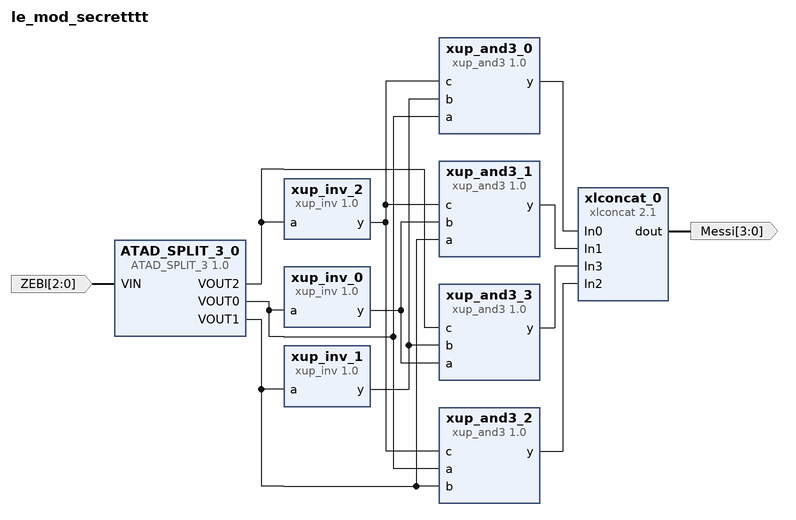
[diagram p0: block diagram of the top level]
# Vivado block design le_mod_secretttt, xc7a100tcsg324-1, Vivado 2018.3
create_bd_design le_mod_secretttt

create_bd_port -dir I -from 2 -to 0 ZEBI
create_bd_port -dir O -from 3 -to 0 Messi

create_bd_cell -type ip -vlnv xilinx.com:xup:xup_and3:1.0 xup_and3_0
create_bd_cell -type ip -vlnv xilinx.com:xup:xup_and3:1.0 xup_and3_1
create_bd_cell -type ip -vlnv xilinx.com:xup:xup_and3:1.0 xup_and3_2
create_bd_cell -type ip -vlnv xilinx.com:xup:xup_and3:1.0 xup_and3_3
create_bd_cell -type ip -vlnv xilinx.com:xup:xup_inv:1.0 xup_inv_0
create_bd_cell -type ip -vlnv xilinx.com:xup:xup_inv:1.0 xup_inv_1
create_bd_cell -type ip -vlnv xilinx.com:user:ATAD_SPLIT_3:1.0 ATAD_SPLIT_3_0
create_bd_cell -type ip -vlnv xilinx.com:xup:xup_inv:1.0 xup_inv_2
create_bd_cell -type ip -vlnv xilinx.com:ip:xlconcat:2.1 xlconcat_0
set_property -dict {CONFIG.NUM_PORTS 4} [get_bd_cells xlconcat_0]

# ---- connections ----

connect_bd_net [get_bd_ports ZEBI] [get_bd_pins ATAD_SPLIT_3_0/VIN]
connect_bd_net [get_bd_pins ATAD_SPLIT_3_0/VOUT0] [get_bd_pins xup_and3_0/a] [get_bd_pins xup_inv_0/a] [get_bd_pins xup_and3_2/a]
connect_bd_net [get_bd_pins ATAD_SPLIT_3_0/VOUT1] [get_bd_pins xup_inv_1/a] [get_bd_pins xup_and3_1/a] [get_bd_pins xup_and3_2/b]
connect_bd_net [get_bd_pins xup_inv_1/y] [get_bd_pins xup_and3_0/b] [get_bd_pins xup_and3_3/b]
connect_bd_net [get_bd_pins ATAD_SPLIT_3_0/VOUT2] [get_bd_pins xup_inv_2/a] [get_bd_pins xup_and3_3/c]
connect_bd_net [get_bd_pins xup_inv_2/y] [get_bd_pins xup_and3_0/c] [get_bd_pins xup_and3_1/c] [get_bd_pins xup_and3_2/c]
connect_bd_net [get_bd_pins xup_inv_0/y] [get_bd_pins xup_and3_1/b] [get_bd_pins xup_and3_3/a]
connect_bd_net [get_bd_pins xup_and3_0/y] [get_bd_pins xlconcat_0/In0]
connect_bd_net [get_bd_pins xup_and3_1/y] [get_bd_pins xlconcat_0/In1]
connect_bd_net [get_bd_pins xup_and3_2/y] [get_bd_pins xlconcat_0/In2]
connect_bd_net [get_bd_pins xup_and3_3/y] [get_bd_pins xlconcat_0/In3]
connect_bd_net [get_bd_pins xlconcat_0/dout] [get_bd_ports Messi]

validate_bd_design
save_bd_design
